# Altium schematic sheet HVManager.SchDoc
size A
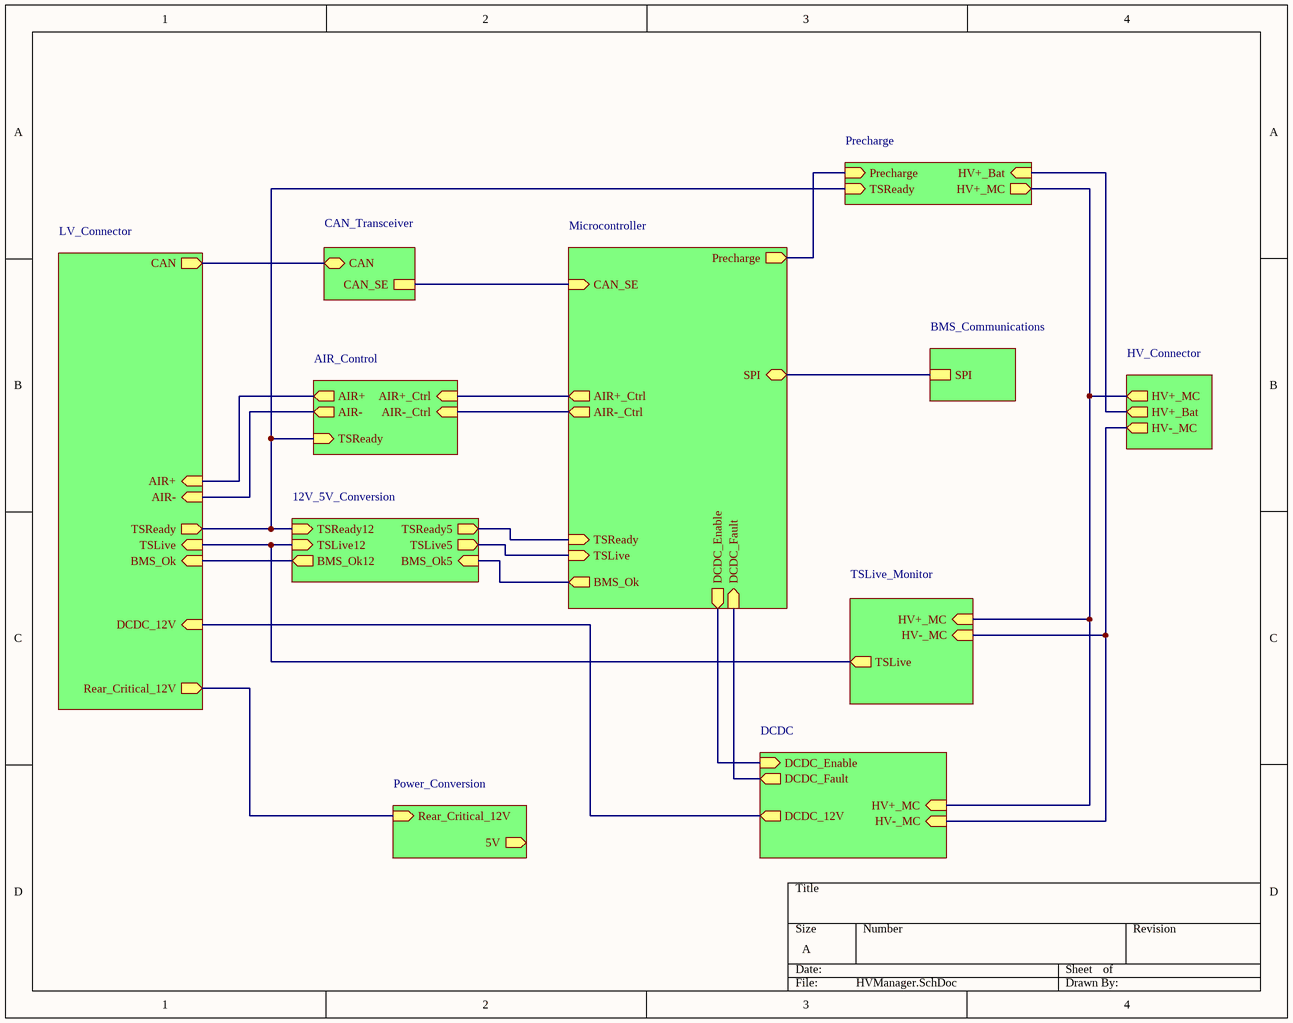
[diagram p0: HVManager.SchDoc]

## Sub-sheets
12V_5V_Conversion = ?: TSReady12 (in), TSReady5 (out), TSLive5 (out), BMS_Ok5 (in), TSLive12 (in), BMS_Ok12 (out)
AIR_Control = ?: TSReady (in), AIR- (out), AIR+ (out), AIR+_Ctrl (in), AIR-_Ctrl (in)
BMS_Communications = ?: SPI (harness Harness)
CAN_Transceiver = ?: CAN_SE (harness Harness), CAN (bidir, harness Harness)
DCDC = ?: HV+_MC (in), HV-_MC (in), DCDC_12V (out), DCDC_Enable (in), DCDC_Fault (out)
HV_Connector = ?: HV+_MC (out), HV+_Bat (out), HV-_MC (out)
LV_Connector = ?: CAN (out, harness Harness), Rear_Critical_12V (out), BMS_Ok (in), TSReady (out), DCDC_12V (in), AIR+ (in), AIR- (in), TSLive (in)
Microcontroller = ?: Precharge (out), CAN_SE (in, harness Harness), BMS_Ok (out), SPI (bidir, harness Harness), DCDC_Enable (out), DCDC_Fault (in), AIR-_Ctrl (out), AIR+_Ctrl (out), TSLive (in), TSReady (in)
Power_Conversion = ?: Rear_Critical_12V (in), 5V (out)
Precharge = ?: HV+_Bat (in), HV+_MC (out), Precharge (in), TSReady (in)
TSLive_Monitor = ?: HV+_MC (in), HV-_MC (in), TSLive (out)

## Nets
(unnamed): sheet Precharge/HV+_Bat, sheet HV_Connector/HV+_Bat
(unnamed): sheet Precharge/HV+_MC, sheet DCDC/HV+_MC, sheet TSLive_Monitor/HV+_MC, sheet HV_Connector/HV+_MC
(unnamed): sheet Precharge/Precharge, sheet Microcontroller/Precharge
(unnamed): sheet Precharge/TSReady, sheet LV_Connector/TSReady, sheet AIR_Control/TSReady, sheet 12V_5V_Conversion/TSReady12
(unnamed): sheet Microcontroller/BMS_Ok, sheet 12V_5V_Conversion/BMS_Ok5
(unnamed): sheet Microcontroller/DCDC_Enable, sheet DCDC/DCDC_Enable
(unnamed): sheet Microcontroller/DCDC_Fault, sheet DCDC/DCDC_Fault
(unnamed): sheet Microcontroller/AIR-_Ctrl, sheet AIR_Control/AIR-_Ctrl
(unnamed): sheet Microcontroller/AIR+_Ctrl, sheet AIR_Control/AIR+_Ctrl
(unnamed): sheet Microcontroller/TSLive, sheet 12V_5V_Conversion/TSLive5
(unnamed): sheet Microcontroller/TSReady, sheet 12V_5V_Conversion/TSReady5
(unnamed): sheet LV_Connector/Rear_Critical_12V, sheet Power_Conversion/Rear_Critical_12V
(unnamed): sheet LV_Connector/BMS_Ok, sheet 12V_5V_Conversion/BMS_Ok12
(unnamed): sheet LV_Connector/DCDC_12V, sheet DCDC/DCDC_12V
(unnamed): sheet LV_Connector/AIR+, sheet AIR_Control/AIR+
(unnamed): sheet LV_Connector/AIR-, sheet AIR_Control/AIR-
(unnamed): sheet LV_Connector/TSLive, sheet TSLive_Monitor/TSLive, sheet 12V_5V_Conversion/TSLive12
(unnamed): sheet DCDC/HV-_MC, sheet TSLive_Monitor/HV-_MC, sheet HV_Connector/HV-_MC